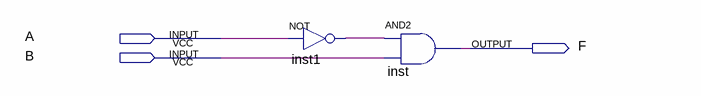
[diagram p0: schematic sheet]
// Quartus schematic menor.bdf as structural Verilog: 2 symbols, 3 pins
module menor (
  input  A,
  input  B,
  output F
);

  wire inst1_out;

  not inst1 (inst1_out, A);
  and inst (F, inst1_out, B);
endmodule
